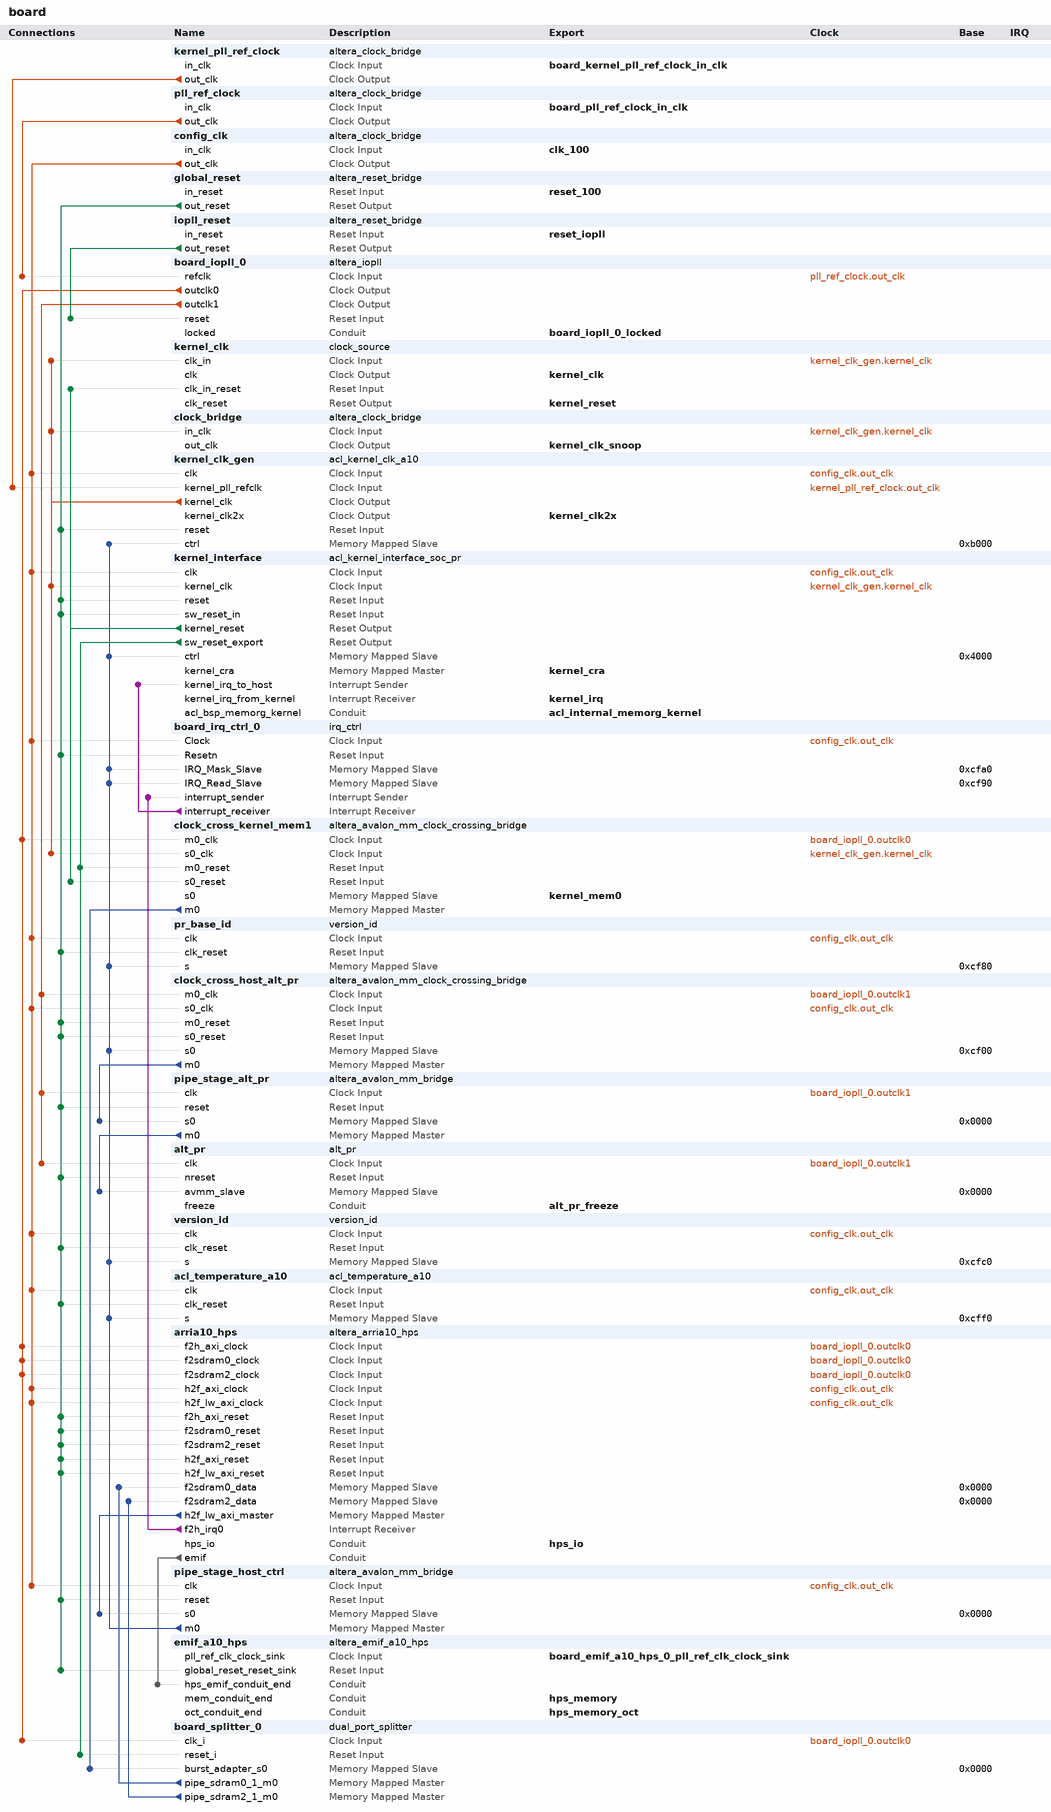
[diagram p0: system contents]
# Platform Designer (Qsys) system board, Arria 10 10AS066N3F40E2SG
# Parameters at their usual value, and those the tool derives, are not listed.
package require -exact qsys 1.0
create_system board
set_project_property DEVICE_FAMILY {Arria 10}
set_project_property DEVICE 10AS066N3F40E2SG

add_component kernel_pll_ref_clock ip/board/board_kernel_pll_ref_clock.ip altera_clock_bridge kernel_pll_ref_clock 17.1
load_component kernel_pll_ref_clock
set_component_parameter_value DERIVED_CLOCK_RATE 0
set_component_parameter_value EXPLICIT_CLOCK_RATE 100000000
save_component

add_component pll_ref_clock ip/board/board_pll_ref_clock.ip altera_clock_bridge pll_ref_clock 17.1
load_component pll_ref_clock
set_component_parameter_value DERIVED_CLOCK_RATE 0
set_component_parameter_value EXPLICIT_CLOCK_RATE 125000000
save_component

add_component config_clk ip/board/board_config_clk.ip altera_clock_bridge config_clk 17.1
load_component config_clk
set_component_parameter_value DERIVED_CLOCK_RATE 0
set_component_parameter_value EXPLICIT_CLOCK_RATE 50000000
save_component

add_component global_reset ip/board/board_global_reset.ip altera_reset_bridge global_reset 17.1
load_component global_reset
set_component_parameter_value ACTIVE_LOW_RESET 1
set_component_parameter_value SYNCHRONOUS_EDGES none
save_component

add_component iopll_reset ip/board/board_reset_bridge_0.ip altera_reset_bridge iopll_reset 17.1
load_component iopll_reset
set_component_parameter_value ACTIVE_LOW_RESET 1
set_component_parameter_value SYNCHRONOUS_EDGES none
save_component

add_component board_iopll_0 ip/board/board_iopll_0.ip altera_iopll board_iopll_0 17.1
load_component board_iopll_0
set_component_parameter_value gui_device_family {Arria 10}
set_component_parameter_value gui_device_component 10AS066N3F40E2SG
set_component_parameter_value gui_device_speed_grade 2
set_component_parameter_value gui_debug_mode false
set_component_parameter_value gui_include_iossm false
set_component_parameter_value gui_cal_code_hex_file iossm.hex
set_component_parameter_value gui_parameter_table_hex_file seq_params_sim.hex
set_component_parameter_value gui_pll_tclk_mux_en false
set_component_parameter_value gui_pll_tclk_sel pll_tclk_m_src
set_component_parameter_value gui_pll_vco_freq_band_0 pll_freq_clk0_disabled
set_component_parameter_value gui_pll_vco_freq_band_1 pll_freq_clk1_disabled
set_component_parameter_value gui_pll_freqcal_en true
set_component_parameter_value gui_pll_freqcal_req_flag true
set_component_parameter_value gui_cal_converge false
set_component_parameter_value gui_cal_error cal_clean
set_component_parameter_value gui_pll_cal_done false
set_component_parameter_value gui_pll_type S10_Simple
set_component_parameter_value gui_pll_m_cnt_in_src c_m_cnt_in_src_ph_mux_clk
set_component_parameter_value gui_c_cnt_in_src0 c_m_cnt_in_src_ph_mux_clk
set_component_parameter_value gui_c_cnt_in_src1 c_m_cnt_in_src_ph_mux_clk
set_component_parameter_value system_info_device_component 10AS066N3F40E2SG
set_component_parameter_value system_info_device_speed_grade 2
set_component_parameter_value system_part_trait_speed_grade 2
set_component_parameter_value gui_usr_device_speed_grade 1
set_component_parameter_value gui_reference_clock_frequency 125.0
set_component_parameter_value gui_refclk_might_change false
set_component_parameter_value gui_prot_mode UNUSED
set_component_parameter_value gui_use_locked true
set_component_parameter_value gui_lock_setting {Low Lock Time}
set_component_parameter_value gui_en_lvds_ports Disabled
set_component_parameter_value gui_operation_mode direct
set_component_parameter_value gui_clock_to_compensate 0
set_component_parameter_value gui_use_NDFB_modes false
set_component_parameter_value gui_number_of_clocks 2
set_component_parameter_value gui_vco_frequency 600.0
set_component_parameter_value gui_mif_gen_options {Generate New MIF File}
set_component_parameter_value gui_new_mif_file_path {~/pll.mif}
set_component_parameter_value gui_existing_mif_file_path {~/pll.mif}
set_component_parameter_value gui_mif_config_name unnamed
set_component_parameter_value gui_clock_name_global false
set_component_parameter_value gui_output_clock_frequency0 230.0
set_component_parameter_value gui_output_clock_frequency1 50.0
set_component_parameter_value gui_actual_output_clock_frequency0 230.0
set_component_parameter_value gui_actual_output_clock_frequency1 50.0
set_component_parameter_value gui_actual_output_clock_frequency_range0 228.571429,229.166667,229.545455,230.0,230.113636,230.46875
set_component_parameter_value gui_actual_output_clock_frequency_range1 44.230769,46.0,47.916667,50.0,52.272727,54.761905
set_component_parameter_value gui_actual_phase_shift0 0.0
set_component_parameter_value gui_actual_phase_shift1 0.0
set_component_parameter_value gui_actual_phase_shift_range0 0.0,108.7,217.4,326.1,434.8,543.5
set_component_parameter_value gui_actual_phase_shift_range1 0.0,108.7,217.4,326.1,434.8,543.5
set_component_parameter_value gui_actual_phase_shift_deg0 0.0
set_component_parameter_value gui_actual_phase_shift_deg1 0.0
set_component_parameter_value gui_actual_phase_shift_deg_range0 0.0,9.0,18.0,27.0,36.0,45.0
set_component_parameter_value gui_actual_phase_shift_deg_range1 0.0,2.0,3.9,5.9,7.8,9.8
set_component_parameter_value gui_actual_duty_cycle0 50.0
set_component_parameter_value gui_actual_duty_cycle1 50.0
set_component_parameter_value gui_actual_duty_cycle_range0 20.0,30.0,40.0,50.0,60.0,70.0
set_component_parameter_value gui_actual_duty_cycle_range1 43.48,45.65,47.83,50.0,52.17,54.35
set_component_parameter_value parameterTable_names {M-Counter Divide Setting,N-Counter Divide Setting,VCO Frequency,C-Counter-0 Divide Setting,C-Counter-1 Divide Setting,C-Counter-2 Divide Setting,C-Counter-3 Divide Setting,C-Counter-4 Divide Setting,C-Counter-5 Divide Setting,C-Counter-6 Divide Setting,C-Counter-7 Divide Setting,C-Counter-8 Divide Setting,PLL Auto Reset,M-Counter Hi Divide,M-Counter Lo Divide,M-Counter Even Duty Enable,M-Counter Bypass Enable,N-Counter Hi Divide,N-Counter Lo Divide,N-Counter Even Duty Enable,N-Counter Bypass Enable,C-Counter-0 Hi Divide,C-Counter-1 Hi Divide,C-Counter-2 Hi Divide,C-Counter-3 Hi Divide,C-Counter-4 Hi Divide,C-Counter-5 Hi Divide,C-Counter-6 Hi Divide,C-Counter-7 Hi Divide,C-Counter-8 Hi Divide,C-Counter-0 Lo Divide,C-Counter-1 Lo Divide,C-Counter-2 Lo Divide,C-Counter-3 Lo Divide,C-Counter-4 Lo Divide,C-Counter-5 Lo Divide,C-Counter-6 Lo Divide,C-Counter-7 Lo Divide,C-Counter-8 Lo Divide,C-Counter-0 Even Duty Enable,C-Counter-1 Even Duty Enable,C-Counter-2 Even Duty Enable,C-Counter-3 Even Duty Enable,C-Counter-4 Even Duty Enable,C-Counter-5 Even Duty Enable,C-Counter-6 Even Duty Enable,C-Counter-7 Even Duty Enable,C-Counter-8 Even Duty Enable,C-Counter-0 Bypass Enable,C-Counter-1 Bypass Enable,C-Counter-2 Bypass Enable,C-Counter-3 Bypass Enable,C-Counter-4 Bypass Enable,C-Counter-5 Bypass Enable,C-Counter-6 Bypass Enable,C-Counter-7 Bypass Enable,C-Counter-8 Bypass Enable,C-Counter-0 Preset,C-Counter-1 Preset,C-Counter-2 Preset,C-Counter-3 Preset,C-Counter-4 Preset,C-Counter-5 Preset,C-Counter-6 Preset,C-Counter-7 Preset,C-Counter-8 Preset,C-Counter-0 Phase Mux Preset,C-Counter-1 Phase Mux Preset,C-Counter-2 Phase Mux Preset,C-Counter-3 Phase Mux Preset,C-Counter-4 Phase Mux Preset,C-Counter-5 Phase Mux Preset,C-Counter-6 Phase Mux Preset,C-Counter-7 Phase Mux Preset,C-Counter-8 Phase Mux Preset,Charge Pump Current,Bandwidth Control}
set_component_parameter_value parameterTable_values {46,5,1150.0 MHz,5,23,1,1,1,1,1,1,1,false,23,23,false,false,3,2,true,false,3,12,256,256,256,256,256,256,256,2,11,256,256,256,256,256,256,256,true,true,false,false,false,false,false,false,false,false,false,true,true,true,true,true,true,true,1,1,1,1,1,1,1,1,1,0,0,0,0,0,0,0,0,0,pll_cp_setting14,pll_bw_res_setting5}
set_component_parameter_value mifTable_names {The MIF file specified does not yet exist}
set_component_parameter_value pll_m_cnt_basic 1
set_component_parameter_value pll_m_cnt 1
set_component_parameter_value prot_mode BASIC
set_component_parameter_value m_cnt_hi_div 23
set_component_parameter_value eff_m_cnt 1
set_component_parameter_value m_cnt_lo_div 23
set_component_parameter_value n_cnt_hi_div 3
set_component_parameter_value n_cnt_lo_div 2
set_component_parameter_value m_cnt_bypass_en false
set_component_parameter_value n_cnt_bypass_en false
set_component_parameter_value m_cnt_odd_div_duty_en false
set_component_parameter_value n_cnt_odd_div_duty_en true
set_component_parameter_value pll_vco_div 1
set_component_parameter_value pll_cp_current pll_cp_setting14
set_component_parameter_value pll_bwctrl pll_bw_res_setting5
set_component_parameter_value pll_fractional_division 1
set_component_parameter_value fractional_vco_multiplier false
set_component_parameter_value reference_clock_frequency {125.0 MHz}
set_component_parameter_value pll_fractional_cout 1
set_component_parameter_value pll_dsm_out_sel 1st_order
set_component_parameter_value operation_mode direct
set_component_parameter_value number_of_clocks 2
set_component_parameter_value pll_vcoph_div 1
set_component_parameter_value pll_type {Arria 10}
set_component_parameter_value pll_subtype General
set_component_parameter_value pll_output_clk_frequency {1150.0 MHz}
set_component_parameter_value mimic_fbclk_type gclk
set_component_parameter_value pll_bw_sel Low
set_component_parameter_value pll_slf_rst false
set_component_parameter_value pll_fbclk_mux_1 pll_fbclk_mux_1_glb
set_component_parameter_value pll_fbclk_mux_2 pll_fbclk_mux_2_m_cnt
set_component_parameter_value pll_m_cnt_in_src c_m_cnt_in_src_ph_mux_clk
set_component_parameter_value pll_clkin_0_src clk_0
set_component_parameter_value refclk1_frequency {100.0 MHz}
set_component_parameter_value pll_clk_loss_sw_en false
set_component_parameter_value pll_manu_clk_sw_en false
set_component_parameter_value pll_auto_clk_sw_en false
set_component_parameter_value pll_clkin_1_src clk_0
set_component_parameter_value pll_clk_sw_dly 0
set_component_parameter_value pll_extclk_0_cnt_src pll_extclk_cnt_src_vss
set_component_parameter_value pll_extclk_1_cnt_src pll_extclk_cnt_src_vss
set_component_parameter_value pll_lock_fltr_cfg 100
set_component_parameter_value pll_unlock_fltr_cfg 2
set_component_parameter_value lock_mode low_lock_time
set_component_parameter_value clock_to_compensate 0
set_component_parameter_value clock_name_global false
set_component_parameter_value c_cnt_hi_div0 3
set_component_parameter_value c_cnt_hi_div1 12
set_component_parameter_value c_cnt_hi_div2 256
set_component_parameter_value c_cnt_hi_div3 256
set_component_parameter_value c_cnt_hi_div4 256
set_component_parameter_value c_cnt_hi_div5 256
set_component_parameter_value c_cnt_hi_div6 256
set_component_parameter_value c_cnt_hi_div7 256
set_component_parameter_value c_cnt_hi_div8 256
set_component_parameter_value c_cnt_hi_div9 1
set_component_parameter_value c_cnt_hi_div10 1
set_component_parameter_value c_cnt_hi_div11 1
set_component_parameter_value c_cnt_hi_div12 1
set_component_parameter_value c_cnt_hi_div13 1
set_component_parameter_value c_cnt_hi_div14 1
set_component_parameter_value c_cnt_hi_div15 1
set_component_parameter_value c_cnt_hi_div16 1
set_component_parameter_value c_cnt_hi_div17 1
set_component_parameter_value c_cnt_lo_div0 2
set_component_parameter_value c_cnt_lo_div1 11
set_component_parameter_value c_cnt_lo_div2 256
set_component_parameter_value c_cnt_lo_div3 256
set_component_parameter_value c_cnt_lo_div4 256
set_component_parameter_value c_cnt_lo_div5 256
set_component_parameter_value c_cnt_lo_div6 256
set_component_parameter_value c_cnt_lo_div7 256
set_component_parameter_value c_cnt_lo_div8 256
set_component_parameter_value c_cnt_lo_div9 1
set_component_parameter_value c_cnt_lo_div10 1
set_component_parameter_value c_cnt_lo_div11 1
set_component_parameter_value c_cnt_lo_div12 1
set_component_parameter_value c_cnt_lo_div13 1
set_component_parameter_value c_cnt_lo_div14 1
set_component_parameter_value c_cnt_lo_div15 1
set_component_parameter_value c_cnt_lo_div16 1
set_component_parameter_value c_cnt_lo_div17 1
set_component_parameter_value c_cnt_prst0 1
set_component_parameter_value c_cnt_prst1 1
set_component_parameter_value c_cnt_prst2 1
set_component_parameter_value c_cnt_prst3 1
set_component_parameter_value c_cnt_prst4 1
set_component_parameter_value c_cnt_prst5 1
set_component_parameter_value c_cnt_prst6 1
set_component_parameter_value c_cnt_prst7 1
set_component_parameter_value c_cnt_prst8 1
set_component_parameter_value c_cnt_prst9 1
set_component_parameter_value c_cnt_prst10 1
set_component_parameter_value c_cnt_prst11 1
set_component_parameter_value c_cnt_prst12 1
set_component_parameter_value c_cnt_prst13 1
set_component_parameter_value c_cnt_prst14 1
set_component_parameter_value c_cnt_prst15 1
set_component_parameter_value c_cnt_prst16 1
set_component_parameter_value c_cnt_prst17 1
set_component_parameter_value c_cnt_ph_mux_prst0 0
set_component_parameter_value c_cnt_ph_mux_prst1 0
set_component_parameter_value c_cnt_ph_mux_prst2 0
set_component_parameter_value c_cnt_ph_mux_prst3 0
set_component_parameter_value c_cnt_ph_mux_prst4 0
set_component_parameter_value c_cnt_ph_mux_prst5 0
set_component_parameter_value c_cnt_ph_mux_prst6 0
set_component_parameter_value c_cnt_ph_mux_prst7 0
set_component_parameter_value c_cnt_ph_mux_prst8 0
set_component_parameter_value c_cnt_ph_mux_prst9 0
set_component_parameter_value c_cnt_ph_mux_prst10 0
set_component_parameter_value c_cnt_ph_mux_prst11 0
set_component_parameter_value c_cnt_ph_mux_prst12 0
set_component_parameter_value c_cnt_ph_mux_prst13 0
set_component_parameter_value c_cnt_ph_mux_prst14 0
set_component_parameter_value c_cnt_ph_mux_prst15 0
set_component_parameter_value c_cnt_ph_mux_prst16 0
set_component_parameter_value c_cnt_ph_mux_prst17 0
set_component_parameter_value c_cnt_in_src0 c_m_cnt_in_src_ph_mux_clk
set_component_parameter_value c_cnt_in_src1 c_m_cnt_in_src_ph_mux_clk
set_component_parameter_value c_cnt_in_src2 c_m_cnt_in_src_ph_mux_clk
set_component_parameter_value c_cnt_in_src3 c_m_cnt_in_src_ph_mux_clk
set_component_parameter_value c_cnt_in_src4 c_m_cnt_in_src_ph_mux_clk
set_component_parameter_value c_cnt_in_src5 c_m_cnt_in_src_ph_mux_clk
set_component_parameter_value c_cnt_in_src6 c_m_cnt_in_src_ph_mux_clk
set_component_parameter_value c_cnt_in_src7 c_m_cnt_in_src_ph_mux_clk
set_component_parameter_value c_cnt_in_src8 c_m_cnt_in_src_ph_mux_clk
set_component_parameter_value c_cnt_in_src9 c_m_cnt_in_src_ph_mux_clk
set_component_parameter_value c_cnt_in_src10 c_m_cnt_in_src_ph_mux_clk
set_component_parameter_value c_cnt_in_src11 c_m_cnt_in_src_ph_mux_clk
set_component_parameter_value c_cnt_in_src12 c_m_cnt_in_src_ph_mux_clk
set_component_parameter_value c_cnt_in_src13 c_m_cnt_in_src_ph_mux_clk
set_component_parameter_value c_cnt_in_src14 c_m_cnt_in_src_ph_mux_clk
set_component_parameter_value c_cnt_in_src15 c_m_cnt_in_src_ph_mux_clk
set_component_parameter_value c_cnt_in_src16 c_m_cnt_in_src_ph_mux_clk
set_component_parameter_value c_cnt_in_src17 c_m_cnt_in_src_ph_mux_clk
set_component_parameter_value c_cnt_bypass_en0 false
set_component_parameter_value c_cnt_bypass_en1 false
set_component_parameter_value c_cnt_bypass_en2 true
set_component_parameter_value c_cnt_bypass_en3 true
set_component_parameter_value c_cnt_bypass_en4 true
set_component_parameter_value c_cnt_bypass_en5 true
set_component_parameter_value c_cnt_bypass_en6 true
set_component_parameter_value c_cnt_bypass_en7 true
set_component_parameter_value c_cnt_bypass_en8 true
set_component_parameter_value c_cnt_bypass_en9 true
set_component_parameter_value c_cnt_bypass_en10 true
set_component_parameter_value c_cnt_bypass_en11 true
set_component_parameter_value c_cnt_bypass_en12 true
set_component_parameter_value c_cnt_bypass_en13 true
set_component_parameter_value c_cnt_bypass_en14 true
set_component_parameter_value c_cnt_bypass_en15 true
set_component_parameter_value c_cnt_bypass_en16 true
set_component_parameter_value c_cnt_bypass_en17 true
set_component_parameter_value c_cnt_odd_div_duty_en0 true
set_component_parameter_value c_cnt_odd_div_duty_en1 true
set_component_parameter_value c_cnt_odd_div_duty_en2 false
set_component_parameter_value c_cnt_odd_div_duty_en3 false
set_component_parameter_value c_cnt_odd_div_duty_en4 false
set_component_parameter_value c_cnt_odd_div_duty_en5 false
set_component_parameter_value c_cnt_odd_div_duty_en6 false
set_component_parameter_value c_cnt_odd_div_duty_en7 false
set_component_parameter_value c_cnt_odd_div_duty_en8 false
set_component_parameter_value c_cnt_odd_div_duty_en9 false
set_component_parameter_value c_cnt_odd_div_duty_en10 false
set_component_parameter_value c_cnt_odd_div_duty_en11 false
set_component_parameter_value c_cnt_odd_div_duty_en12 false
set_component_parameter_value c_cnt_odd_div_duty_en13 false
set_component_parameter_value c_cnt_odd_div_duty_en14 false
set_component_parameter_value c_cnt_odd_div_duty_en15 false
set_component_parameter_value c_cnt_odd_div_duty_en16 false
set_component_parameter_value c_cnt_odd_div_duty_en17 false
set_component_parameter_value output_clock_frequency0 {230.000000 MHz}
set_component_parameter_value output_clock_frequency1 {50.000000 MHz}
set_component_parameter_value output_clock_frequency2 {0 ps}
set_component_parameter_value output_clock_frequency3 {0 ps}
set_component_parameter_value output_clock_frequency4 {0 ps}
set_component_parameter_value output_clock_frequency5 {0 ps}
set_component_parameter_value output_clock_frequency6 {0 ps}
set_component_parameter_value output_clock_frequency7 {0 ps}
set_component_parameter_value output_clock_frequency8 {0 ps}
set_component_parameter_value output_clock_frequency9 {0 MHz}
set_component_parameter_value output_clock_frequency10 {0 MHz}
set_component_parameter_value output_clock_frequency11 {0 MHz}
set_component_parameter_value output_clock_frequency12 {0 MHz}
set_component_parameter_value output_clock_frequency13 {0 MHz}
set_component_parameter_value output_clock_frequency14 {0 MHz}
set_component_parameter_value output_clock_frequency15 {0 MHz}
set_component_parameter_value output_clock_frequency16 {0 MHz}
set_component_parameter_value output_clock_frequency17 {0 MHz}
set_component_parameter_value phase_shift0 {0 ps}
set_component_parameter_value phase_shift1 {0 ps}
set_component_parameter_value phase_shift2 {0 ps}
set_component_parameter_value phase_shift3 {0 ps}
set_component_parameter_value phase_shift4 {0 ps}
set_component_parameter_value phase_shift5 {0 ps}
set_component_parameter_value phase_shift6 {0 ps}
set_component_parameter_value phase_shift7 {0 ps}
set_component_parameter_value phase_shift8 {0 ps}
set_component_parameter_value phase_shift9 {0 ps}
set_component_parameter_value phase_shift10 {0 ps}
set_component_parameter_value phase_shift11 {0 ps}
set_component_parameter_value phase_shift12 {0 ps}
set_component_parameter_value phase_shift13 {0 ps}
set_component_parameter_value phase_shift14 {0 ps}
set_component_parameter_value phase_shift15 {0 ps}
set_component_parameter_value phase_shift16 {0 ps}
set_component_parameter_value phase_shift17 {0 ps}
set_component_parameter_value duty_cycle0 50
set_component_parameter_value duty_cycle1 50
set_component_parameter_value duty_cycle2 50
set_component_parameter_value duty_cycle3 50
set_component_parameter_value duty_cycle4 50
set_component_parameter_value duty_cycle5 50
set_component_parameter_value duty_cycle6 50
set_component_parameter_value duty_cycle7 50
set_component_parameter_value duty_cycle8 50
set_component_parameter_value duty_cycle9 50
set_component_parameter_value duty_cycle10 50
set_component_parameter_value duty_cycle11 50
set_component_parameter_value duty_cycle12 50
set_component_parameter_value duty_cycle13 50
set_component_parameter_value duty_cycle14 50
set_component_parameter_value duty_cycle15 50
set_component_parameter_value duty_cycle16 50
set_component_parameter_value duty_cycle17 50
set_component_parameter_value clock_name_0 outclk0
set_component_parameter_value clock_name_1 outclk1
set_component_parameter_value clock_name_global_0 false
set_component_parameter_value clock_name_global_1 false
set_component_parameter_value clock_name_global_2 false
set_component_parameter_value clock_name_global_3 false
set_component_parameter_value clock_name_global_4 false
set_component_parameter_value clock_name_global_5 false
set_component_parameter_value clock_name_global_6 false
set_component_parameter_value clock_name_global_7 false
set_component_parameter_value clock_name_global_8 false
set_component_parameter_value pll_tclk_mux_en false
set_component_parameter_value pll_tclk_sel pll_tclk_m_src
set_component_parameter_value pll_vco_freq_band_0 pll_freq_clk0_disabled
set_component_parameter_value pll_vco_freq_band_1 pll_freq_clk1_disabled
set_component_parameter_value pll_freqcal_en true
set_component_parameter_value pll_freqcal_req_flag true
set_component_parameter_value cal_converge false
set_component_parameter_value cal_error cal_clean
set_component_parameter_value pll_cal_done false
set_component_parameter_value include_iossm false
set_component_parameter_value cal_code_hex_file iossm.hex
set_component_parameter_value parameter_table_hex_file seq_params_sim.hex
set_component_parameter_value iossm_nios_sim_clk_period_ps 1333
set_component_parameter_value hp_number_of_family_allowable_clocks 9
set_component_parameter_value hp_previous_num_clocks 1
set_component_parameter_value hp_actual_vco_frequency_fp 600.0
set_component_parameter_value hp_qsys_scripting_mode false
set_component_parameter_value hp_actual_output_clock_frequency_fp0 230.0
set_component_parameter_value hp_actual_output_clock_frequency_fp1 50.0
set_component_parameter_value hp_actual_output_clock_frequency_fp2 100.0
set_component_parameter_value hp_actual_output_clock_frequency_fp3 100.0
set_component_parameter_value hp_actual_output_clock_frequency_fp4 100.0
set_component_parameter_value hp_actual_output_clock_frequency_fp5 100.0
set_component_parameter_value hp_actual_output_clock_frequency_fp6 100.0
set_component_parameter_value hp_actual_output_clock_frequency_fp7 100.0
set_component_parameter_value hp_actual_output_clock_frequency_fp8 100.0
set_component_parameter_value hp_actual_output_clock_frequency_fp9 100.0
set_component_parameter_value hp_actual_output_clock_frequency_fp10 100.0
set_component_parameter_value hp_actual_output_clock_frequency_fp11 100.0
set_component_parameter_value hp_actual_output_clock_frequency_fp12 100.0
set_component_parameter_value hp_actual_output_clock_frequency_fp13 100.0
set_component_parameter_value hp_actual_output_clock_frequency_fp14 100.0
set_component_parameter_value hp_actual_output_clock_frequency_fp15 100.0
set_component_parameter_value hp_actual_output_clock_frequency_fp16 100.0
set_component_parameter_value hp_actual_output_clock_frequency_fp17 100.0
set_component_parameter_value hp_actual_phase_shift_fp0 0.0
set_component_parameter_value hp_actual_phase_shift_fp1 0.0
set_component_parameter_value hp_actual_phase_shift_fp2 0.0
set_component_parameter_value hp_actual_phase_shift_fp3 0.0
set_component_parameter_value hp_actual_phase_shift_fp4 0.0
set_component_parameter_value hp_actual_phase_shift_fp5 0.0
set_component_parameter_value hp_actual_phase_shift_fp6 0.0
set_component_parameter_value hp_actual_phase_shift_fp7 0.0
set_component_parameter_value hp_actual_phase_shift_fp8 0.0
set_component_parameter_value hp_actual_phase_shift_fp9 0.0
set_component_parameter_value hp_actual_phase_shift_fp10 0.0
set_component_parameter_value hp_actual_phase_shift_fp11 0.0
set_component_parameter_value hp_actual_phase_shift_fp12 0.0
set_component_parameter_value hp_actual_phase_shift_fp13 0.0
set_component_parameter_value hp_actual_phase_shift_fp14 0.0
set_component_parameter_value hp_actual_phase_shift_fp15 0.0
set_component_parameter_value hp_actual_phase_shift_fp16 0.0
set_component_parameter_value hp_actual_phase_shift_fp17 0.0
set_component_parameter_value hp_actual_duty_cycle_fp0 50.0
set_component_parameter_value hp_actual_duty_cycle_fp1 50.0
set_component_parameter_value hp_actual_duty_cycle_fp2 50.0
set_component_parameter_value hp_actual_duty_cycle_fp3 50.0
set_component_parameter_value hp_actual_duty_cycle_fp4 50.0
set_component_parameter_value hp_actual_duty_cycle_fp5 50.0
set_component_parameter_value hp_actual_duty_cycle_fp6 50.0
set_component_parameter_value hp_actual_duty_cycle_fp7 50.0
set_component_parameter_value hp_actual_duty_cycle_fp8 50.0
set_component_parameter_value hp_actual_duty_cycle_fp9 50.0
set_component_parameter_value hp_actual_duty_cycle_fp10 50.0
set_component_parameter_value hp_actual_duty_cycle_fp11 50.0
set_component_parameter_value hp_actual_duty_cycle_fp12 50.0
set_component_parameter_value hp_actual_duty_cycle_fp13 50.0
set_component_parameter_value hp_actual_duty_cycle_fp14 50.0
set_component_parameter_value hp_actual_duty_cycle_fp15 50.0
set_component_parameter_value hp_actual_duty_cycle_fp16 50.0
set_component_parameter_value hp_actual_duty_cycle_fp17 50.0
save_component

add_component kernel_clk ip/board/board_kernel_clk_export.ip clock_source kernel_clk 
load_component kernel_clk
set_component_parameter_value clockFrequency 40000000
set_component_parameter_value clockFrequencyKnown false
set_component_parameter_value resetSynchronousEdges DEASSERT
save_component

add_component clock_bridge ip/board/board_clock_bridge.ip altera_clock_bridge clock_bridge 17.1
load_component clock_bridge
set_component_parameter_value DERIVED_CLOCK_RATE 400000000
set_component_parameter_value EXPLICIT_CLOCK_RATE 0
save_component

add_component kernel_clk_gen ip/board/board_kernel_clk_gen_0.ip acl_kernel_clk_a10 kernel_clk_gen 16.1
load_component kernel_clk_gen
set_component_parameter_value REF_CLK_RATE 100.0
set_component_parameter_value KERNEL_TARGET_CLOCK_RATE 400.0
save_component

add_component kernel_interface acl_kernel_interface_soc_pr.qsys acl_kernel_interface_soc_pr kernel_interface 

add_component board_irq_ctrl_0 ip/board/board_irq_ctrl_0.ip irq_ctrl board_irq_ctrl_0 1.0
load_component board_irq_ctrl_0
save_component

add_component clock_cross_kernel_mem1 ip/board/board_clock_cross_kernel_mem1.ip altera_avalon_mm_clock_crossing_bridge clock_cross_kernel_mem1 17.1
load_component clock_cross_kernel_mem1
set_component_parameter_value DATA_WIDTH 256
set_component_parameter_value ADDRESS_WIDTH 30
set_component_parameter_value USE_AUTO_ADDRESS_WIDTH 1
set_component_parameter_value ADDRESS_UNITS WORDS
set_component_parameter_value MAX_BURST_SIZE 16
set_component_parameter_value COMMAND_FIFO_DEPTH 64
set_component_parameter_value RESPONSE_FIFO_DEPTH 64
set_component_parameter_value MASTER_SYNC_DEPTH 2
set_component_parameter_value SLAVE_SYNC_DEPTH 2
save_component

add_component pr_base_id ip/board/board_pr_base_id.ip version_id pr_base_id 10.0
load_component pr_base_id
set_component_parameter_value WIDTH 32
set_component_parameter_value VERSION_ID -1597521440
save_component

add_component clock_cross_host_alt_pr ip/board/board_clock_cross_host_alt_pr.ip altera_avalon_mm_clock_crossing_bridge clock_cross_host_alt_pr 17.1
load_component clock_cross_host_alt_pr
set_component_parameter_value DATA_WIDTH 32
set_component_parameter_value ADDRESS_WIDTH 6
set_component_parameter_value USE_AUTO_ADDRESS_WIDTH 0
set_component_parameter_value MAX_BURST_SIZE 1
set_component_parameter_value COMMAND_FIFO_DEPTH 4
set_component_parameter_value RESPONSE_FIFO_DEPTH 4
set_component_parameter_value MASTER_SYNC_DEPTH 2
set_component_parameter_value SLAVE_SYNC_DEPTH 2
save_component

add_component pipe_stage_alt_pr ip/board/board_pipe_stage_alt_pr.ip altera_avalon_mm_bridge pipe_stage_alt_pr 17.1
load_component pipe_stage_alt_pr
set_component_parameter_value DATA_WIDTH 32
set_component_parameter_value ADDRESS_WIDTH 6
set_component_parameter_value USE_AUTO_ADDRESS_WIDTH 0
set_component_parameter_value ADDRESS_UNITS SYMBOLS
set_component_parameter_value MAX_PENDING_RESPONSES 4
save_component

add_component alt_pr ip/board/board_alt_pr.ip alt_pr alt_pr 17.1
load_component alt_pr
set_component_parameter_value PR_INTERNAL_HOST true
set_component_parameter_value ENABLE_JTAG false
set_component_parameter_value ENABLE_AVMM_SLAVE true
set_component_parameter_value ENABLE_INTERRUPT false
set_component_parameter_value ENABLE_FREEZE true
set_component_parameter_value ENABLE_HPR_UI false
set_component_parameter_value ENABLE_HPR false
set_component_parameter_value ENABLE_PRPOF_ID_CHECK_UI false
set_component_parameter_value ENABLE_PRPOF_ID_CHECK true
set_component_parameter_value EXT_HOST_PRPOF_ID 0
set_component_parameter_value EXT_HOST_TARGET_DEVICE_FAMILY {Stratix V}
set_component_parameter_value DATA_WIDTH_INDEX 32
set_component_parameter_value CB_DATA_WIDTH 32
set_component_parameter_value ENABLE_DATA_PACKING true
set_component_parameter_value CDRATIO 1
set_component_parameter_value EDCRC_OSC_DIVIDER 1
set_component_parameter_value ENABLE_ENHANCED_DECOMPRESSION false
set_component_parameter_value INSTANTIATE_PR_BLOCK true
set_component_parameter_value INSTANTIATE_CRC_BLOCK false
set_component_parameter_value GENERATE_SDC true
save_component

add_component version_id ip/board/board_version_id.ip version_id version_id 10.0
load_component version_id
set_component_parameter_value WIDTH 32
set_component_parameter_value VERSION_ID -1597521438
save_component

add_component acl_temperature_a10 ip/board/board_acl_temperature_a10.ip acl_temperature_a10 acl_temperature_a10 15.1
load_component acl_temperature_a10
save_component

add_instance arria10_hps altera_arria10_hps 17.1
set_instance_parameter_value arria10_hps BOOT_FROM_FPGA_Enable false
set_instance_parameter_value arria10_hps BSEL 1
set_instance_parameter_value arria10_hps BSEL_EN false
set_instance_parameter_value arria10_hps CLK_EMACA_SOURCE 1
set_instance_parameter_value arria10_hps CLK_EMACB_SOURCE 1
set_instance_parameter_value arria10_hps CLK_EMAC_PTP_SOURCE 1
set_instance_parameter_value arria10_hps CLK_GPIO_SOURCE 1
set_instance_parameter_value arria10_hps CLK_HMC_PLL_SOURCE 0
set_instance_parameter_value arria10_hps CLK_MAIN_PLL_SOURCE2 0
set_instance_parameter_value arria10_hps CLK_MPU_CNT 0
set_instance_parameter_value arria10_hps CLK_MPU_SOURCE 0
set_instance_parameter_value arria10_hps CLK_NOC_CNT 0
set_instance_parameter_value arria10_hps CLK_NOC_SOURCE 0
set_instance_parameter_value arria10_hps CLK_PERI_PLL_SOURCE2 0
set_instance_parameter_value arria10_hps CLK_S2F_USER0_SOURCE 0
set_instance_parameter_value arria10_hps CLK_S2F_USER1_SOURCE 0
set_instance_parameter_value arria10_hps CLK_SDMMC_SOURCE 0
set_instance_parameter_value arria10_hps CM_Mode N/A
set_instance_parameter_value arria10_hps CM_PinMuxing Unused
set_instance_parameter_value arria10_hps CTI_Enable false
set_instance_parameter_value arria10_hps CUSTOM_MPU_CLK 800
set_instance_parameter_value arria10_hps DEBUG_APB_Enable false
set_instance_parameter_value arria10_hps DISABLE_PERI_PLL false
set_instance_parameter_value arria10_hps DMA_Enable No,No,No,No,No,No,No,No
set_instance_parameter_value arria10_hps EMAC0_CLK 250
set_instance_parameter_value arria10_hps EMAC0_Mode RGMII_with_MDIO
set_instance_parameter_value arria10_hps EMAC0_PTP false
set_instance_parameter_value arria10_hps EMAC0_PinMuxing IO
set_instance_parameter_value arria10_hps EMAC0_SWITCH_Enable false
set_instance_parameter_value arria10_hps EMAC1_CLK 250
set_instance_parameter_value arria10_hps EMAC1_Mode N/A
set_instance_parameter_value arria10_hps EMAC1_PTP false
set_instance_parameter_value arria10_hps EMAC1_PinMuxing Unused
set_instance_parameter_value arria10_hps EMAC1_SWITCH_Enable false
set_instance_parameter_value arria10_hps EMAC2_CLK 250
set_instance_parameter_value arria10_hps EMAC2_Mode N/A
set_instance_parameter_value arria10_hps EMAC2_PTP false
set_instance_parameter_value arria10_hps EMAC2_PinMuxing Unused
set_instance_parameter_value arria10_hps EMAC2_SWITCH_Enable false
set_instance_parameter_value arria10_hps EMAC_PTP_REF_CLK 100
set_instance_parameter_value arria10_hps EMIF_BYPASS_CHECK false
set_instance_parameter_value arria10_hps EMIF_CONDUIT_Enable true
set_instance_parameter_value arria10_hps F2H_AXI_CLOCK_FREQ 230000000
set_instance_parameter_value arria10_hps F2H_COLD_RST_Enable false
set_instance_parameter_value arria10_hps F2H_DBG_RST_Enable false
set_instance_parameter_value arria10_hps F2H_DELAY 3
set_instance_parameter_value arria10_hps F2H_FREE_CLK_Enable false
set_instance_parameter_value arria10_hps F2H_FREE_CLK_FREQ 200
set_instance_parameter_value arria10_hps F2H_SDRAM0_CLOCK_FREQ 100
set_instance_parameter_value arria10_hps F2H_SDRAM1_CLOCK_FREQ 100
set_instance_parameter_value arria10_hps F2H_SDRAM2_CLOCK_FREQ 100
set_instance_parameter_value arria10_hps F2H_SDRAM3_CLOCK_FREQ 100
set_instance_parameter_value arria10_hps F2H_SDRAM4_CLOCK_FREQ 100
set_instance_parameter_value arria10_hps F2H_SDRAM5_CLOCK_FREQ 100
set_instance_parameter_value arria10_hps F2H_WARM_RST_Enable false
set_instance_parameter_value arria10_hps F2SDRAM0_ENABLED true
set_instance_parameter_value arria10_hps F2SDRAM1_ENABLED false
set_instance_parameter_value arria10_hps F2SDRAM2_DELAY 4
set_instance_parameter_value arria10_hps F2SDRAM2_ENABLED true
set_instance_parameter_value arria10_hps F2SDRAM_ADDRESS_WIDTH 32
set_instance_parameter_value arria10_hps F2SDRAM_PORT_CONFIG 6
set_instance_parameter_value arria10_hps F2SDRAM_READY_LATENCY true
set_instance_parameter_value arria10_hps F2SINTERRUPT_Enable true
set_instance_parameter_value arria10_hps F2S_Width 3
set_instance_parameter_value arria10_hps FPGA_PERIPHERAL_INPUT_CLOCK_FREQ_EMAC0_RX_CLK_IN 100
set_instance_parameter_value arria10_hps FPGA_PERIPHERAL_INPUT_CLOCK_FREQ_EMAC0_TX_CLK_IN 100
set_instance_parameter_value arria10_hps FPGA_PERIPHERAL_INPUT_CLOCK_FREQ_EMAC1_RX_CLK_IN 100
set_instance_parameter_value arria10_hps FPGA_PERIPHERAL_INPUT_CLOCK_FREQ_EMAC1_TX_CLK_IN 100
set_instance_parameter_value arria10_hps FPGA_PERIPHERAL_INPUT_CLOCK_FREQ_EMAC2_RX_CLK_IN 100
set_instance_parameter_value arria10_hps FPGA_PERIPHERAL_INPUT_CLOCK_FREQ_EMAC2_TX_CLK_IN 100
set_instance_parameter_value arria10_hps FPGA_PERIPHERAL_INPUT_CLOCK_FREQ_EMAC_PTP_REF_CLOCK 100
set_instance_parameter_value arria10_hps FPGA_PERIPHERAL_INPUT_CLOCK_FREQ_I2C0_SCL_IN 100
set_instance_parameter_value arria10_hps FPGA_PERIPHERAL_INPUT_CLOCK_FREQ_I2C1_SCL_IN 100
set_instance_parameter_value arria10_hps FPGA_PERIPHERAL_INPUT_CLOCK_FREQ_I2CEMAC0_SCL_IN 100
set_instance_parameter_value arria10_hps FPGA_PERIPHERAL_INPUT_CLOCK_FREQ_I2CEMAC1_SCL_IN 100
set_instance_parameter_value arria10_hps FPGA_PERIPHERAL_INPUT_CLOCK_FREQ_I2CEMAC2_SCL_IN 100
set_instance_parameter_value arria10_hps FPGA_PERIPHERAL_INPUT_CLOCK_FREQ_SDMMC_CLK_IN 100
set_instance_parameter_value arria10_hps FPGA_PERIPHERAL_INPUT_CLOCK_FREQ_SPIS0_SCLK_IN 100
set_instance_parameter_value arria10_hps FPGA_PERIPHERAL_INPUT_CLOCK_FREQ_SPIS1_SCLK_IN 100
set_instance_parameter_value arria10_hps FPGA_PERIPHERAL_INPUT_CLOCK_FREQ_USB0_CLK_IN 100
set_instance_parameter_value arria10_hps FPGA_PERIPHERAL_INPUT_CLOCK_FREQ_USB1_CLK_IN 100
set_instance_parameter_value arria10_hps FPGA_PERIPHERAL_OUTPUT_CLOCK_FREQ_EMAC0_GTX_CLK 100
set_instance_parameter_value arria10_hps FPGA_PERIPHERAL_OUTPUT_CLOCK_FREQ_EMAC0_MD_CLK 2.5
set_instance_parameter_value arria10_hps FPGA_PERIPHERAL_OUTPUT_CLOCK_FREQ_EMAC1_GTX_CLK 100
set_instance_parameter_value arria10_hps FPGA_PERIPHERAL_OUTPUT_CLOCK_FREQ_EMAC1_MD_CLK 2.5
set_instance_parameter_value arria10_hps FPGA_PERIPHERAL_OUTPUT_CLOCK_FREQ_EMAC2_GTX_CLK 100
set_instance_parameter_value arria10_hps FPGA_PERIPHERAL_OUTPUT_CLOCK_FREQ_EMAC2_MD_CLK 2.5
set_instance_parameter_value arria10_hps FPGA_PERIPHERAL_OUTPUT_CLOCK_FREQ_I2C0_CLK 100
set_instance_parameter_value arria10_hps FPGA_PERIPHERAL_OUTPUT_CLOCK_FREQ_I2C1_CLK 100
set_instance_parameter_value arria10_hps FPGA_PERIPHERAL_OUTPUT_CLOCK_FREQ_I2CEMAC0_CLK 100
set_instance_parameter_value arria10_hps FPGA_PERIPHERAL_OUTPUT_CLOCK_FREQ_I2CEMAC1_CLK 100
set_instance_parameter_value arria10_hps FPGA_PERIPHERAL_OUTPUT_CLOCK_FREQ_I2CEMAC2_CLK 100
set_instance_parameter_value arria10_hps FPGA_PERIPHERAL_OUTPUT_CLOCK_FREQ_QSPI_SCLK_OUT 100
set_instance_parameter_value arria10_hps FPGA_PERIPHERAL_OUTPUT_CLOCK_FREQ_SDMMC_CCLK 100
set_instance_parameter_value arria10_hps FPGA_PERIPHERAL_OUTPUT_CLOCK_FREQ_SPIM0_SCLK_OUT 100
set_instance_parameter_value arria10_hps FPGA_PERIPHERAL_OUTPUT_CLOCK_FREQ_SPIM1_SCLK_OUT 100
set_instance_parameter_value arria10_hps GPIO_REF_CLK 4
set_instance_parameter_value arria10_hps GP_Enable false
set_instance_parameter_value arria10_hps H2F_AXI_CLOCK_FREQ 50000000
set_instance_parameter_value arria10_hps H2F_COLD_RST_Enable false
set_instance_parameter_value arria10_hps H2F_CTI_CLOCK_FREQ 100
set_instance_parameter_value arria10_hps H2F_DEBUG_APB_CLOCK_FREQ 100
set_instance_parameter_value arria10_hps H2F_DELAY 3
set_instance_parameter_value arria10_hps H2F_LW_AXI_CLOCK_FREQ 50000000
set_instance_parameter_value arria10_hps H2F_LW_DELAY 3
set_instance_parameter_value arria10_hps H2F_PENDING_RST_Enable false
set_instance_parameter_value arria10_hps H2F_TPIU_CLOCK_IN_FREQ 100
set_instance_parameter_value arria10_hps H2F_USER0_CLK_Enable false
set_instance_parameter_value arria10_hps H2F_USER0_CLK_FREQ 400
set_instance_parameter_value arria10_hps H2F_USER1_CLK_Enable false
set_instance_parameter_value arria10_hps H2F_USER1_CLK_FREQ 400
set_instance_parameter_value arria10_hps HMC_PLL_REF_CLK 800
set_instance_parameter_value arria10_hps HPS_DIV_GPIO_FREQ 125
set_instance_parameter_value arria10_hps HPS_IO_Enable SDMMC:D0,SDMMC:CMD,SDMMC:CCLK,SDMMC:D1,SDMMC:D2,SDMMC:D3,SDMMC:PWR_ENA,NONE,SDMMC:D4,SDMMC:D5,SDMMC:D6,SDMMC:D7,UART1:TX,UART1:RX,USB0:CLK,USB0:STP,USB0:DIR,USB0:DATA0,USB0:DATA1,USB0:NXT,USB0:DATA2,USB0:DATA3,USB0:DATA4,USB0:DATA5,USB0:DATA6,USB0:DATA7,EMAC0:TX_CLK,EMAC0:TX_CTL,EMAC0:RX_CLK,EMAC0:RX_CTL,EMAC0:TXD0,EMAC0:TXD1,EMAC0:RXD0,EMAC0:RXD1,EMAC0:TXD2,EMAC0:TXD3,EMAC0:RXD2,EMAC0:RXD3,SPIM1:CLK,SPIM1:MOSI,SPIM1:MISO,SPIM1:SS0_N,SPIM1:SS1_N,GPIO,NONE,NONE,NONE,NONE,MDIO0:MDIO,MDIO0:MDC,I2C1:SDA,I2C1:SCL,GPIO,NONE,GPIO,GPIO,NONE,NONE,NONE,NONE,NONE,NONE
set_instance_parameter_value arria10_hps I2C0_Mode N/A
set_instance_parameter_value arria10_hps I2C0_PinMuxing Unused
set_instance_parameter_value arria10_hps I2C1_Mode default
set_instance_parameter_value arria10_hps I2C1_PinMuxing IO
set_instance_parameter_value arria10_hps I2CEMAC0_Mode N/A
set_instance_parameter_value arria10_hps I2CEMAC0_PinMuxing Unused
set_instance_parameter_value arria10_hps I2CEMAC1_Mode N/A
set_instance_parameter_value arria10_hps I2CEMAC1_PinMuxing Unused
set_instance_parameter_value arria10_hps I2CEMAC2_Mode N/A
set_instance_parameter_value arria10_hps I2CEMAC2_PinMuxing Unused
set_instance_parameter_value arria10_hps INTERNAL_OSCILLATOR_ENABLE 60
set_instance_parameter_value arria10_hps JTAG_Enable false
set_instance_parameter_value arria10_hps L3_MAIN_FREE_CLK 400
set_instance_parameter_value arria10_hps L4_SYS_FREE_CLK 1
set_instance_parameter_value arria10_hps LWH2F_Enable 1
set_instance_parameter_value arria10_hps MPU_CLK_VCCL 0
set_instance_parameter_value arria10_hps MPU_EVENTS_Enable false
set_instance_parameter_value arria10_hps NAND_Mode N/A
set_instance_parameter_value arria10_hps NAND_PinMuxing Unused
set_instance_parameter_value arria10_hps NOCDIV_CS_ATCLK 0
set_instance_parameter_value arria10_hps NOCDIV_CS_PDBGCLK 1
set_instance_parameter_value arria10_hps NOCDIV_CS_TRACECLK 1
set_instance_parameter_value arria10_hps NOCDIV_L4MAINCLK 0
set_instance_parameter_value arria10_hps NOCDIV_L4MPCLK 1
set_instance_parameter_value arria10_hps NOCDIV_L4SPCLK 2
set_instance_parameter_value arria10_hps OVERIDE_PERI_PLL false
set_instance_parameter_value arria10_hps PERI_PLL_MANUAL_VCO_FREQ 2000
set_instance_parameter_value arria10_hps PLL_CLK0 Unused
set_instance_parameter_value arria10_hps PLL_CLK1 Unused
set_instance_parameter_value arria10_hps PLL_CLK2 Unused
set_instance_parameter_value arria10_hps PLL_CLK3 Unused
set_instance_parameter_value arria10_hps PLL_CLK4 Unused
set_instance_parameter_value arria10_hps QSPI_Mode N/A
set_instance_parameter_value arria10_hps QSPI_PinMuxing Unused
set_instance_parameter_value arria10_hps RUN_INTERNAL_BUILD_CHECKS 0
set_instance_parameter_value arria10_hps S2FINTERRUPT_CLOCKPERIPHERAL_Enable false
set_instance_parameter_value arria10_hps S2FINTERRUPT_CTI_Enable false
set_instance_parameter_value arria10_hps S2FINTERRUPT_DMA_Enable false
set_instance_parameter_value arria10_hps S2FINTERRUPT_EMAC0_Enable false
set_instance_parameter_value arria10_hps S2FINTERRUPT_EMAC1_Enable false
set_instance_parameter_value arria10_hps S2FINTERRUPT_EMAC2_Enable false
set_instance_parameter_value arria10_hps S2FINTERRUPT_FPGAMANAGER_Enable false
set_instance_parameter_value arria10_hps S2FINTERRUPT_GPIO_Enable false
set_instance_parameter_value arria10_hps S2FINTERRUPT_HMC_Enable false
set_instance_parameter_value arria10_hps S2FINTERRUPT_I2C0_Enable false
set_instance_parameter_value arria10_hps S2FINTERRUPT_I2C1_Enable false
set_instance_parameter_value arria10_hps S2FINTERRUPT_I2CEMAC0_Enable false
set_instance_parameter_value arria10_hps S2FINTERRUPT_I2CEMAC1_Enable false
set_instance_parameter_value arria10_hps S2FINTERRUPT_I2CEMAC2_Enable false
set_instance_parameter_value arria10_hps S2FINTERRUPT_L4TIMER_Enable false
set_instance_parameter_value arria10_hps S2FINTERRUPT_NAND_Enable false
set_instance_parameter_value arria10_hps S2FINTERRUPT_QSPI_Enable false
set_instance_parameter_value arria10_hps S2FINTERRUPT_SDMMC_Enable false
set_instance_parameter_value arria10_hps S2FINTERRUPT_SPIM0_Enable false
set_instance_parameter_value arria10_hps S2FINTERRUPT_SPIM1_Enable false
set_instance_parameter_value arria10_hps S2FINTERRUPT_SPIS0_Enable false
set_instance_parameter_value arria10_hps S2FINTERRUPT_SPIS1_Enable false
set_instance_parameter_value arria10_hps S2FINTERRUPT_SYSTEMMANAGER_Enable false
set_instance_parameter_value arria10_hps S2FINTERRUPT_SYSTIMER_Enable false
set_instance_parameter_value arria10_hps S2FINTERRUPT_UART0_Enable false
set_instance_parameter_value arria10_hps S2FINTERRUPT_UART1_Enable false
set_instance_parameter_value arria10_hps S2FINTERRUPT_USB0_Enable false
set_instance_parameter_value arria10_hps S2FINTERRUPT_USB1_Enable false
set_instance_parameter_value arria10_hps S2FINTERRUPT_WATCHDOG_Enable false
set_instance_parameter_value arria10_hps S2F_Width 1
set_instance_parameter_value arria10_hps SDMMC_Mode 8-bit_PWREN
set_instance_parameter_value arria10_hps SDMMC_PinMuxing IO
set_instance_parameter_value arria10_hps SDMMC_REF_CLK 200
set_instance_parameter_value arria10_hps SECURITY_MODULE_Enable false
set_instance_parameter_value arria10_hps SPIM0_Mode N/A
set_instance_parameter_value arria10_hps SPIM0_PinMuxing Unused
set_instance_parameter_value arria10_hps SPIM1_Mode Dual_slave_selects
set_instance_parameter_value arria10_hps SPIM1_PinMuxing IO
set_instance_parameter_value arria10_hps SPIS0_Mode N/A
set_instance_parameter_value arria10_hps SPIS0_PinMuxing Unused
set_instance_parameter_value arria10_hps SPIS1_Mode N/A
set_instance_parameter_value arria10_hps SPIS1_PinMuxing Unused
set_instance_parameter_value arria10_hps STM_Enable false
set_instance_parameter_value arria10_hps TESTIOCTRL_DEBUGCLKSEL 16
set_instance_parameter_value arria10_hps TESTIOCTRL_MAINCLKSEL 8
set_instance_parameter_value arria10_hps TESTIOCTRL_PERICLKSEL 8
set_instance_parameter_value arria10_hps TEST_Enable false
set_instance_parameter_value arria10_hps TRACE_Mode N/A
set_instance_parameter_value arria10_hps TRACE_PinMuxing Unused
set_instance_parameter_value arria10_hps UART0_Mode N/A
set_instance_parameter_value arria10_hps UART0_PinMuxing Unused
set_instance_parameter_value arria10_hps UART1_Mode No_flow_control
set_instance_parameter_value arria10_hps UART1_PinMuxing IO
set_instance_parameter_value arria10_hps USB0_Mode default
set_instance_parameter_value arria10_hps USB0_PinMuxing IO
set_instance_parameter_value arria10_hps USB1_Mode N/A
set_instance_parameter_value arria10_hps USB1_PinMuxing Unused
set_instance_parameter_value arria10_hps USE_DEFAULT_MPU_CLK false
set_instance_parameter_value arria10_hps device_name 10AS066N3F40E2SG
set_instance_parameter_value arria10_hps eosc1_clk_mhz 25.0
set_instance_parameter_value arria10_hps quartus_ini_hps_ip_boot_from_fpga_ready false
set_instance_parameter_value arria10_hps quartus_ini_hps_ip_enable_a10_advanced_options false
set_instance_parameter_value arria10_hps quartus_ini_hps_ip_enable_jtag false
set_instance_parameter_value arria10_hps quartus_ini_hps_ip_enable_sdmmc_clk_in false
set_instance_parameter_value arria10_hps quartus_ini_hps_ip_enable_test_interface false
set_instance_parameter_value arria10_hps quartus_ini_hps_ip_overide_f2sdram_delay false
set_instance_parameter_value arria10_hps quartus_ini_hps_ip_override_sdmmc_4bit false
